# EAGLE design XStepper (EAGLE 6.4)
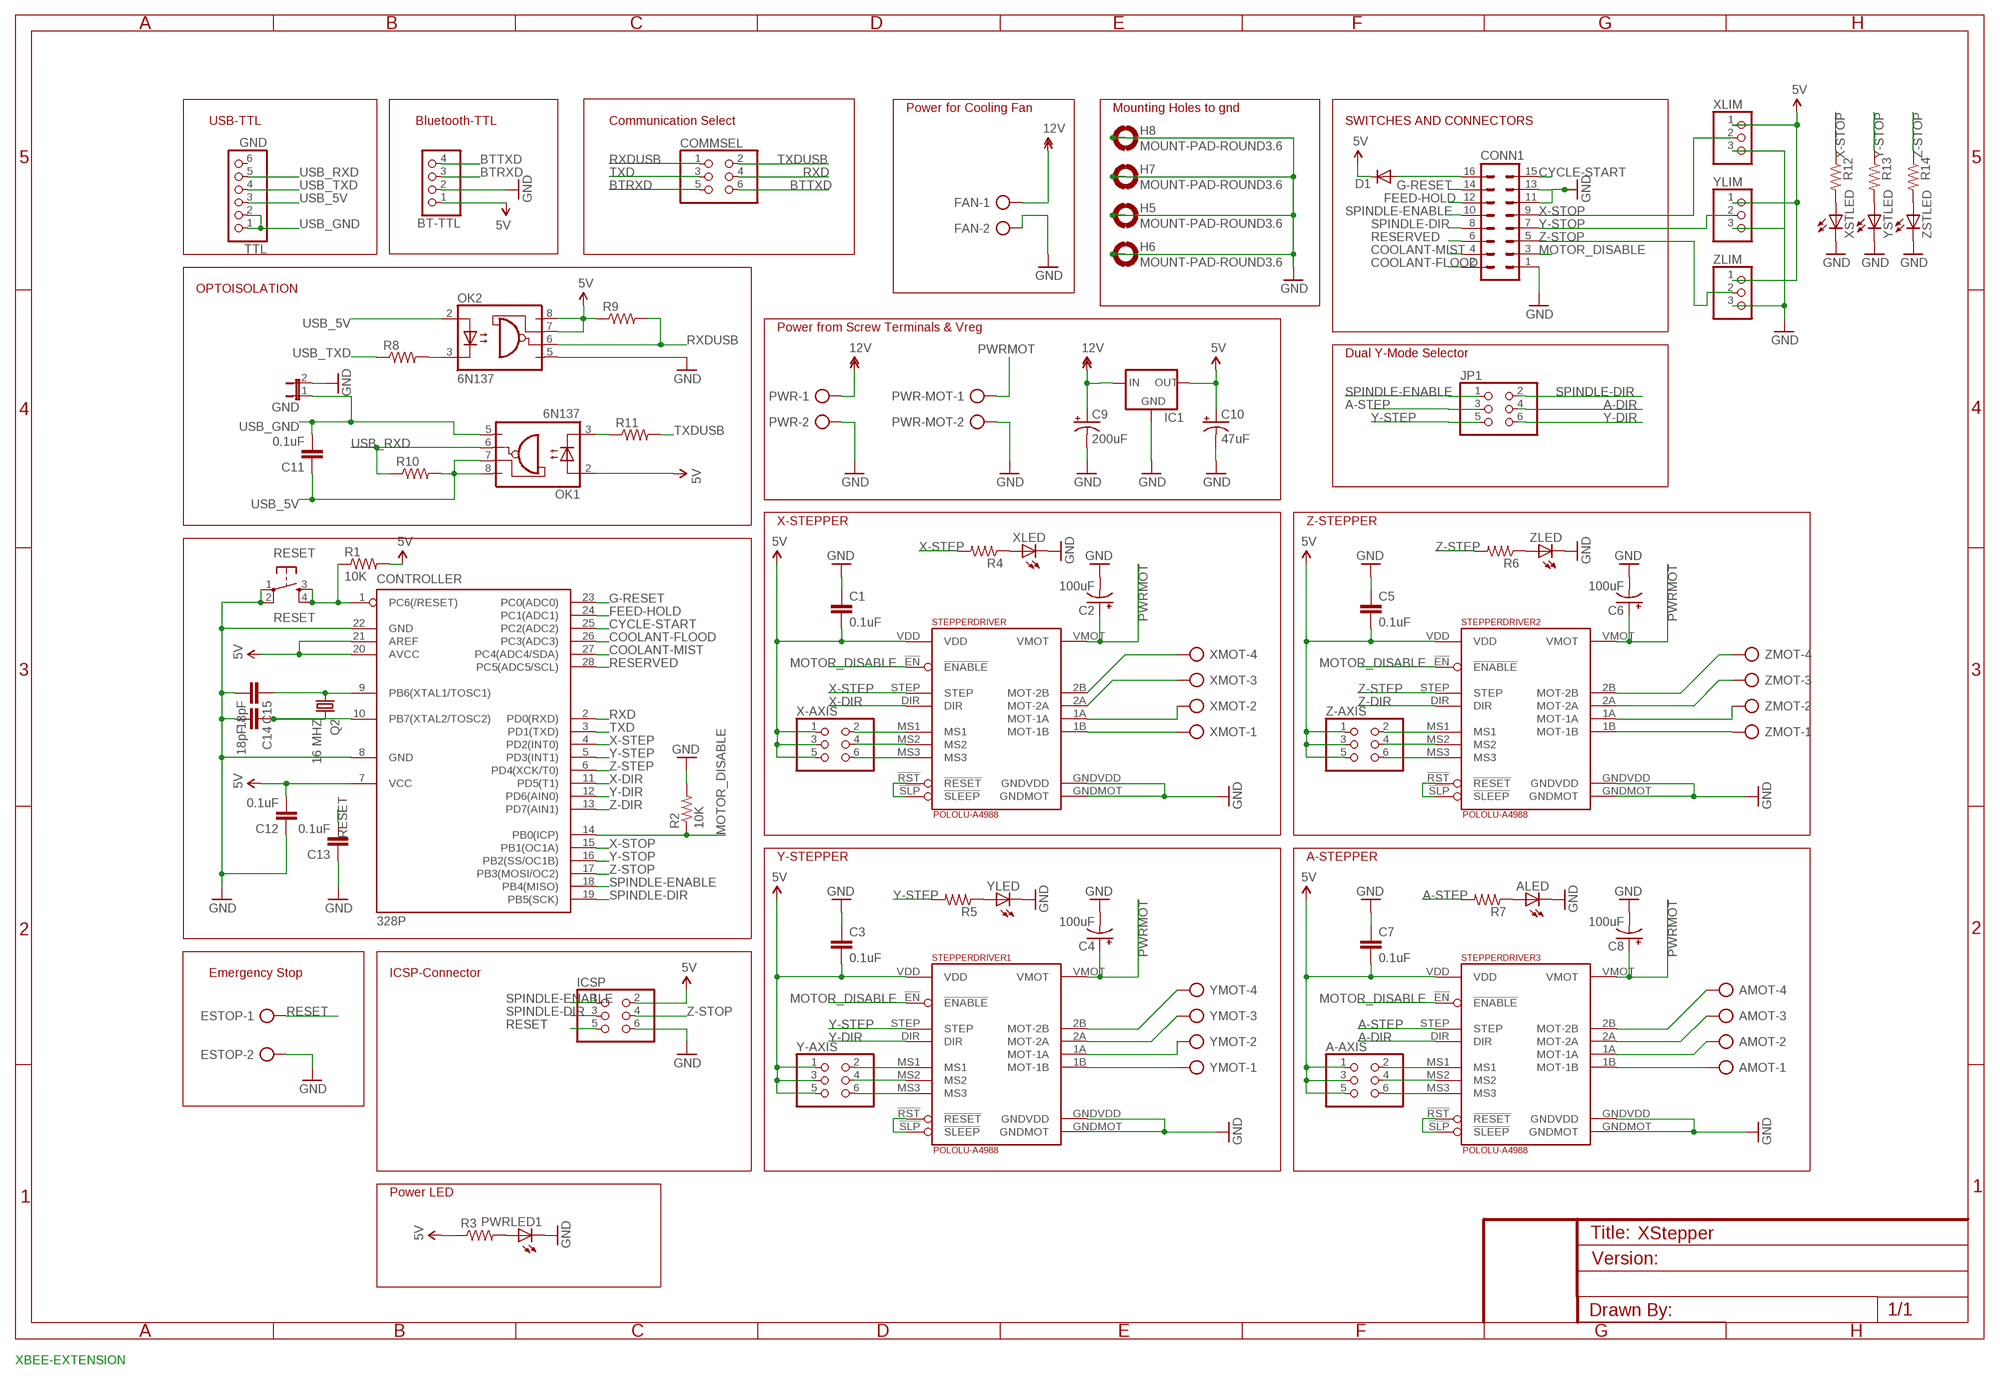
[diagram p0: schematic, sheet 1]

## Parts
328P  CONTROLLER  MEGA8-P  [DIL28-3]
A-AXIS  PINHD-2X3  [2X03]
ALED  LED3MM  [LED3MM]
AMOT  AK500/4  [AK500/4]
BT-TTL  PINHD-1X4  [1X04]
C1  0.1uF  C-EU025-025X050  [C025-025X050]
C2  100uF  CPOL-USE2.5-6  [E2,5-6]
C3  0.1uF  C-EU025-025X050  [C025-025X050]
C4  100uF  CPOL-USE2.5-6  [E2,5-6]
C5  0.1uF  C-EU025-025X050  [C025-025X050]
C6  100uF  CPOL-USE2.5-6  [E2,5-6]
C7  0.1uF  C-EU025-025X050  [C025-025X050]
C8  100uF  CPOL-USE2.5-6  [E2,5-6]
C9  200uF  CPOL-USE2.5-6  [E2,5-6]
C10  47uF  CPOL-USE2.5-6  [E2,5-6]
C11  0.1uF  C-EU025-025X050  [C025-025X050]
C12  0.1uF  C-EU025-025X050  [C025-025X050]
C13  0.1uF  C-EU025-025X050  [C025-025X050]
C14  18pF  C-EU025-025X050  [C025-025X050]
C15  18pF  C-EU025-025X050  [C025-025X050]
COMMSEL  PINHD-2X3  [2X03]
CONN1  ML16  [ML16]
D1  DIODEPTH  [DIODE-1N4001]
ESTOP  AK500/2  [AK500/2]
FAN  AK500/2  [AK500/2]
GND  JP1E  [JP1]
H5  MOUNT-PAD-ROUND3.6  [3,6-PAD]
H6  MOUNT-PAD-ROUND3.6  [3,6-PAD]
H7  MOUNT-PAD-ROUND3.6  [3,6-PAD]
H8  MOUNT-PAD-ROUND3.6  [3,6-PAD]
IC1  V_REG_78XXSINK  [TO220-IGO]
ICSP  PINHD-2X3  [2X03]
JP1  PINHD-2X3  [2X03]
OK1  6N137  [DIL08]
OK2  6N137  [DIL08]
PWR  AK500/2  [AK500/2]
PWR-MOT  AK500/2  [AK500/2]
PWRLED1  LED3MM  [LED3MM]
Q2  16 MHZ  CRYSTALHC49S  [HC49/S]
R1  10K  RESISTORAXIAL-0.3  [AXIAL-0.3]
R2  10K  RESISTORAXIAL-0.3  [AXIAL-0.3]
R3  RESISTORAXIAL-0.3  [AXIAL-0.3]
R4  RESISTORAXIAL-0.3  [AXIAL-0.3]
R5  RESISTORAXIAL-0.3  [AXIAL-0.3]
R6  RESISTORAXIAL-0.3  [AXIAL-0.3]
R7  RESISTORAXIAL-0.3  [AXIAL-0.3]
R8  RESISTORAXIAL-0.3  [AXIAL-0.3]
R9  RESISTORAXIAL-0.3  [AXIAL-0.3]
R10  RESISTORAXIAL-0.3  [AXIAL-0.3]
R11  RESISTORAXIAL-0.3  [AXIAL-0.3]
R12  RESISTORAXIAL-0.3  [AXIAL-0.3]
R13  RESISTORAXIAL-0.3  [AXIAL-0.3]
R14  RESISTORAXIAL-0.3  [AXIAL-0.3]
RESET  RESET  TAC_SWITCHPTH  [TACTILE-PTH]
STEPPERDRIVER  POLOLU-A4988  POLOLU-ALLEGRO  [POLOLU-ALLEGRO-PTH]
STEPPERDRIVER1  POLOLU-A4988  POLOLU-ALLEGRO  [POLOLU-ALLEGRO-PTH]
STEPPERDRIVER2  POLOLU-A4988  POLOLU-ALLEGRO  [POLOLU-ALLEGRO-PTH]
STEPPERDRIVER3  POLOLU-A4988  POLOLU-ALLEGRO  [POLOLU-ALLEGRO-PTH]
TTL  GND  PINHD-1X6  [1X06]
X-AXIS  PINHD-2X3  [2X03]
XLED  LED3MM  [LED3MM]
XLIM  PINHD-1X3  [1X03]
XMOT  AK500/4  [AK500/4]
XSTLED  LED3MM  [LED3MM]
Y-AXIS  PINHD-2X3  [2X03]
YLED  LED3MM  [LED3MM]
YLIM  PINHD-1X3  [1X03]
YMOT  AK500/4  [AK500/4]
YSTLED  LED3MM  [LED3MM]
Z-AXIS  PINHD-2X3  [2X03]
ZLED  LED3MM  [LED3MM]
ZLIM  PINHD-1X3  [1X03]
ZMOT  AK500/4  [AK500/4]
ZSTLED  LED3MM  [LED3MM]

## Nets
5V: 328P.7(VCC) 328P.20(AVCC) 328P.21(AREF) A-AXIS.1 A-AXIS.3 A-AXIS.5 BT-TTL.1 C1.2 C3.2 C5.2 C7.2 C10.+ C12.2 D1.C IC1.OUT ICSP.2 OK1.2(A) OK2.7(VE) OK2.8(VCC) R1.P$2 R3.P$1 R9.P$1 STEPPERDRIVER1.VDD STEPPERDRIVER2.VDD STEPPERDRIVER3.VDD STEPPERDRIVER.VDD X-AXIS.1 X-AXIS.3 X-AXIS.5 XLIM.1 Y-AXIS.1 Y-AXIS.3 Y-AXIS.5 YLIM.1 Z-AXIS.1 Z-AXIS.3 Z-AXIS.5 ZLIM.1
12V [power]: C9.+ FAN.1 IC1.IN PWR.1
A-DIR: JP1.4 STEPPERDRIVER3.DIR
A-STEP: JP1.3 R7.P$2 STEPPERDRIVER3.STEP
BTRXD: BT-TTL.3 COMMSEL.5
BTTXD: BT-TTL.4 COMMSEL.6
COOLANT-FLOOD: 328P.26(PC3(ADC3)) CONN1.2
COOLANT-MIST: 328P.27(PC4(ADC4/SDA)) CONN1.4
CYCLE-START: 328P.25(PC2(ADC2)) CONN1.15
FEED-HOLD: 328P.24(PC1(ADC1)) CONN1.12
G-RESET: 328P.23(PC0(ADC0)) CONN1.14
GND [power]: 328P.8(GND) 328P.22(GND) ALED.K(C) BT-TTL.2 C1.1 C2.- C3.1 C4.- C5.1 C6.- C7.1 C8.- C9.- C10.- C12.1 C13.1 C14.2 C15.2 CONN1.1 CONN1.11 CONN1.13 ESTOP.2 FAN.2 GND.2 H5.B3,6(MOUNT) H6.B3,6(MOUNT) H7.B3,6(MOUNT) H8.B3,6(MOUNT) IC1.GND ICSP.6 OK2.5(GND) PWR-MOT.2 PWR.2 PWRLED1.K(C) R2.P$2 RESET.1 RESET.2 STEPPERDRIVER1.GNDMOT STEPPERDRIVER1.GNDVDD STEPPERDRIVER2.GNDMOT STEPPERDRIVER2.GNDVDD STEPPERDRIVER3.GNDMOT STEPPERDRIVER3.GNDVDD STEPPERDRIVER.GNDMOT STEPPERDRIVER.GNDVDD XLED.K(C) XLIM.3 XSTLED.K(C) YLED.K(C) YLIM.3 YSTLED.K(C) ZLED.K(C) ZLIM.3 ZSTLED.K(C)
MOTOR_DISABLE: 328P.14(PB0(ICP)) CONN1.3 R2.P$1 STEPPERDRIVER1.!EN(!ENABLE) STEPPERDRIVER2.!EN(!ENABLE) STEPPERDRIVER3.!EN(!ENABLE) STEPPERDRIVER.!EN(!ENABLE)
N$1 [power]: STEPPERDRIVER.1B(MOT-1B) XMOT.1
N$2 [power]: STEPPERDRIVER.1A(MOT-1A) XMOT.2
N$3 [power]: STEPPERDRIVER.2A(MOT-2A) XMOT.3
N$4 [power]: STEPPERDRIVER.2B(MOT-2B) XMOT.4
N$5: STEPPERDRIVER.!RST(!RESET) STEPPERDRIVER.!SLP(!SLEEP)
N$6: STEPPERDRIVER.MS1 X-AXIS.2
N$7: STEPPERDRIVER.MS2 X-AXIS.4
N$8: STEPPERDRIVER.MS3 X-AXIS.6
N$9 [power]: STEPPERDRIVER1.1B(MOT-1B) YMOT.1
N$10 [power]: STEPPERDRIVER1.1A(MOT-1A) YMOT.2
N$11 [power]: STEPPERDRIVER1.2A(MOT-2A) YMOT.3
N$12 [power]: STEPPERDRIVER1.2B(MOT-2B) YMOT.4
N$13: STEPPERDRIVER1.!RST(!RESET) STEPPERDRIVER1.!SLP(!SLEEP)
N$14: STEPPERDRIVER1.MS1 Y-AXIS.2
N$15: STEPPERDRIVER1.MS2 Y-AXIS.4
N$16: STEPPERDRIVER1.MS3 Y-AXIS.6
N$17 [power]: STEPPERDRIVER2.2B(MOT-2B) ZMOT.4
N$18 [power]: STEPPERDRIVER2.2A(MOT-2A) ZMOT.3
N$19 [power]: STEPPERDRIVER2.1A(MOT-1A) ZMOT.2
N$20 [power]: STEPPERDRIVER2.1B(MOT-1B) ZMOT.1
N$21: STEPPERDRIVER2.!RST(!RESET) STEPPERDRIVER2.!SLP(!SLEEP)
N$22: STEPPERDRIVER2.MS1 Z-AXIS.2
N$23: STEPPERDRIVER2.MS2 Z-AXIS.4
N$24: STEPPERDRIVER2.MS3 Z-AXIS.6
N$25 [power]: AMOT.1 STEPPERDRIVER3.1B(MOT-1B)
N$26 [power]: AMOT.2 STEPPERDRIVER3.1A(MOT-1A)
N$27 [power]: AMOT.3 STEPPERDRIVER3.2A(MOT-2A)
N$28 [power]: AMOT.4 STEPPERDRIVER3.2B(MOT-2B)
N$29: STEPPERDRIVER3.!RST(!RESET) STEPPERDRIVER3.!SLP(!SLEEP)
N$30: A-AXIS.2 STEPPERDRIVER3.MS1
N$31: A-AXIS.4 STEPPERDRIVER3.MS2
N$32: A-AXIS.6 STEPPERDRIVER3.MS3
N$33: 328P.9(PB6(XTAL1/TOSC1)) C15.1 Q2.1
N$34: 328P.10(PB7(XTAL2/TOSC2)) C14.1 Q2.2
N$35: OK2.3(C) R8.P$2
N$36: OK1.3(C) R11.P$1
N$37: R12.P$2 XSTLED.A
N$38: R4.P$1 XLED.A
N$39: R5.P$1 YLED.A
N$40: R6.P$1 ZLED.A
N$41: ALED.A R7.P$1
N$42: R13.P$2 YSTLED.A
N$43: PWRLED1.A R3.P$2
N$44: R14.P$2 ZSTLED.A
N$45: CONN1.16 D1.A
PWRMOT: C2.+ C4.+ C6.+ C8.+ PWR-MOT.1 STEPPERDRIVER1.VMOT STEPPERDRIVER2.VMOT STEPPERDRIVER3.VMOT STEPPERDRIVER.VMOT
RESERVED: 328P.28(PC5(ADC5/SCL)) CONN1.6
RESET: 328P.1(PC6(/RESET)) C13.2 ESTOP.1 ICSP.5 R1.P$1 RESET.3 RESET.4
RXD: 328P.2(PD0(RXD)) COMMSEL.4
RXDUSB: COMMSEL.1 OK2.6(VO) R9.P$2
SPINDLE-DIR: 328P.19(PB5(SCK)) CONN1.8 ICSP.3 JP1.2
SPINDLE-ENABLE: 328P.18(PB4(MISO)) CONN1.10 ICSP.1 JP1.1
TXD: 328P.3(PD1(TXD)) COMMSEL.3
TXDUSB: COMMSEL.2 R11.P$2
USB_5V: C11.1 OK1.7(VE) OK1.8(VCC) OK2.2(A) R10.P$2 TTL.3
USB_GND [power]: C11.2 GND.1 OK1.5(GND) TTL.1 TTL.2
USB_RXD: OK1.6(VO) R10.P$1 TTL.5
USB_TXD: R8.P$1 TTL.4
X-DIR: 328P.11(PD5(T1)) STEPPERDRIVER.DIR
X-STEP: 328P.4(PD2(INT0)) R4.P$2 STEPPERDRIVER.STEP
X-STOP: 328P.15(PB1(OC1A)) CONN1.9 R12.P$1 XLIM.2
Y-DIR: 328P.12(PD6(AIN0)) JP1.6 STEPPERDRIVER1.DIR
Y-STEP: 328P.5(PD3(INT1)) JP1.5 R5.P$2 STEPPERDRIVER1.STEP
Y-STOP: 328P.16(PB2(SS/OC1B)) CONN1.7 R13.P$1 YLIM.2
Z-DIR: 328P.13(PD7(AIN1)) STEPPERDRIVER2.DIR
Z-STEP: 328P.6(PD4(XCK/T0)) R6.P$2 STEPPERDRIVER2.STEP
Z-STOP: 328P.17(PB3(MOSI/OC2)) CONN1.5 ICSP.4 R14.P$1 ZLIM.2
Unconnected: TTL.6

## Notes on the sheet
- Power for Cooling Fan | Mounting Holes to gnd
- USB-TTL | Bluetooth-TTL | Communication Select | SWITCHES AND CONNECTORS
- OPTOISOLATION
- Power from Screw Terminals & Vreg
- Dual Y-Mode Selector
- X-STEPPER | Z-STEPPER
- Y-STEPPER | A-STEPPER
- Emergency Stop | ICSP-Connector
- Power LED
- XBEE-EXTENSION

## Library data of the parts
328P = Bibsatmel:MEGA8-P: MICROCONTROLLER 8 Kbytes FLASH, 1 kbytes SRAM, 512 bytes EEPROM, USART, 4-channel 10 bit ADC, 2-channel 8 bit ADC Pin compatible with Atmega48, ATMega88, ATMega168 Source: avr.lbr; OC_FARNELL: unknown; OC_NEWARK: unknown
A-AXIS COMMSEL ICSP JP1 X-AXIS Y-AXIS Z-AXIS = pinhead:PINHD-2X3: PIN HEADER
ALED PWRLED1 XLED XSTLED YLED YSTLED ZLED ZSTLED = led:LED: LED OSRAM: - CHIPLED LG R971, LG N971, LY N971, LG Q971, LY Q971, LO R971, LY R971 LH N974, LH R974 LS Q976, LO Q976, LY Q976 LO Q996 - Hyper CHIPLED LW Q18S LB Q993, LB Q99A, LB R99A - SideLED LS A670, LO A670, LY A670, LG A670, LP A670 LB A673, LV A673, LT A673, LW A673 LH A674 LY A675 LS A676, LA A676, LO A676, LY A676, LW A676 LS A679, LY A679, LG A679 - Hyper Micro SIDELED® LS Y876, LA Y876, LO Y876, LY Y876 LT Y87S - SmartLED LW L88C, LW L88S LB L89C, LB L89S, LG L890 LS L89K, LO L89K, LY L89K LS L896, LA L896, LO L896, LY L896 - TOPLED LS T670, LO T670, LY T670, LG T670, LP T670 LSG T670, LSP T670, LSY T670, LOP T670, LYG T670 LG T671, LOG T671, LSG T671 LB T673, LV T673, LT T673, LW T673 LH T674 LS T676, LA T676, LO T676, LY T676, LB T676, LH T676, LSB T676, LW T676 LB T67C, LV T67C, LT T67C, LS T67K, LO T67K, LY T67K, LW E67C LS E67B, LA E67B, LO E67B, LY E67B, LB E67C, LV E67C, LT E67C LW T67C LS T679, LY T679, LG T679 LS T770, LO T770, LY T770, LG T770, LP T770 LB T773, LV T773, LT T773, LW T773 LH T774 LS E675, LA E675, LY E675, LS T675 LS T776, LA T776, LO T776, LY T776, LB T776 LHGB T686 LT T68C, LB T68C - Hyper Mini TOPLED® LB M676 - Mini TOPLED Santana® LG M470 LS M47K, LO M47K, LY M47K Source: http://www.osram.convergy.de LUXEON: - LUMILED® LXK2-PW12-R00, LXK2-PW12-S00, LXK2-PW14-U00, LXK2-PW14-V00 LXK2-PM12-R00, LXK2-PM12-S00, LXK2-PM14-U00 LXK2-PE12-Q00, LXK2-PE12-R00, LXK2-PE12-S00, LXK2-PE14-T00, LXK2-PE14-U00 LXK2-PB12-K00, LXK2-PB12-L00, LXK2-PB12-M00, LXK2-PB14-N00, LXK2-PB14-P00, LXK2-PB14-Q00 LXK2-PR12-L00, LXK2-PR12-M00, LXK2-PR14-Q00, LXK2-PR14-R00 LXK2-PD12-Q00, LXK2-PD12-R00, LXK2-PD12-S00 LXK2-PH12-R00, LXK2-PH12-S00 LXK2-PL12-P00, LXK2-PL12-Q00, LXK2-PL12-R00 Source: www.luxeon.com KINGBRIGHT: KA-3528ASYC Source: www.kingbright.com
AMOT XMOT YMOT ZMOT = con-ptr500:AK500/4: CONNECTOR; OC_FARNELL: unknown; OC_NEWARK: unknown
BT-TTL = pinhead:PINHD-1X4: PIN HEADER
C1 C3 C5 C7 C11-C15 = resistor:C-EU: CAPACITOR, European symbol
C2 C4 C6 C8-C10 = resistor:CPOL-US: POLARIZED CAPACITOR, American symbol
CONN1 = con-ml:ML16: HARTING; OC_FARNELL: unknown; OC_NEWARK: unknown
D1 = SparkFun-DiscreteSemi:DIODE: Diode These are standard reverse protection diodes and small signal diodes. SMA package can handle up to about 1A. SOD-323 can handle about 200mA. What the SOD-323 package when ordering, there are some mfgs out there that are 5-pin packages.
ESTOP FAN PWR PWR-MOT = con-ptr500:AK500/2: CONNECTOR; OC_FARNELL: unknown; OC_NEWARK: unknown
GND = jumper:JP1E: JUMPER
H5-H8 = holes:MOUNT-PAD-ROUND: MOUNTING PAD, round
IC1 = SparkFun-PowerIC:V_REG_78XX: Voltage Regulator Standard 7805 5V regulator. IGO (Input Ground Output). Spark Fun Electronics SKU : COM-00107
OK1 OK2 = optocoupler:6N137: MOTOROLA OPTO COUPLER; MPN: 6N137; OC_FARNELL: 1328376; OC_NEWARK: 52M1895
Q2 = crystal:CRYSTAL: CRYSTAL; OC_FARNELL: 1667008; OC_NEWARK: unknown
R1-R14 = SparkFun-Resistors:RESISTOR: Resistor Basic schematic elements and footprints for 0603, 1206, and PTH resistors.
RESET = SparkFun:TAC_SWITCH: Momentary Switch Button commonly used for reset or general input. Spark Fun Electronics SKU : COM-00097
STEPPERDRIVER STEPPERDRIVER1-STEPPERDRIVER3 = pololu-allegro:POLOLU-ALLEGRO
TTL = pinhead:PINHD-1X6: PIN HEADER
XLIM YLIM ZLIM = pinhead:PINHD-1X3: PIN HEADER

## Net classes
0 default: width 0.406 mm, clearance 0.254 mm
1 power: width 1.016 mm, clearance 0.305 mm

## Board
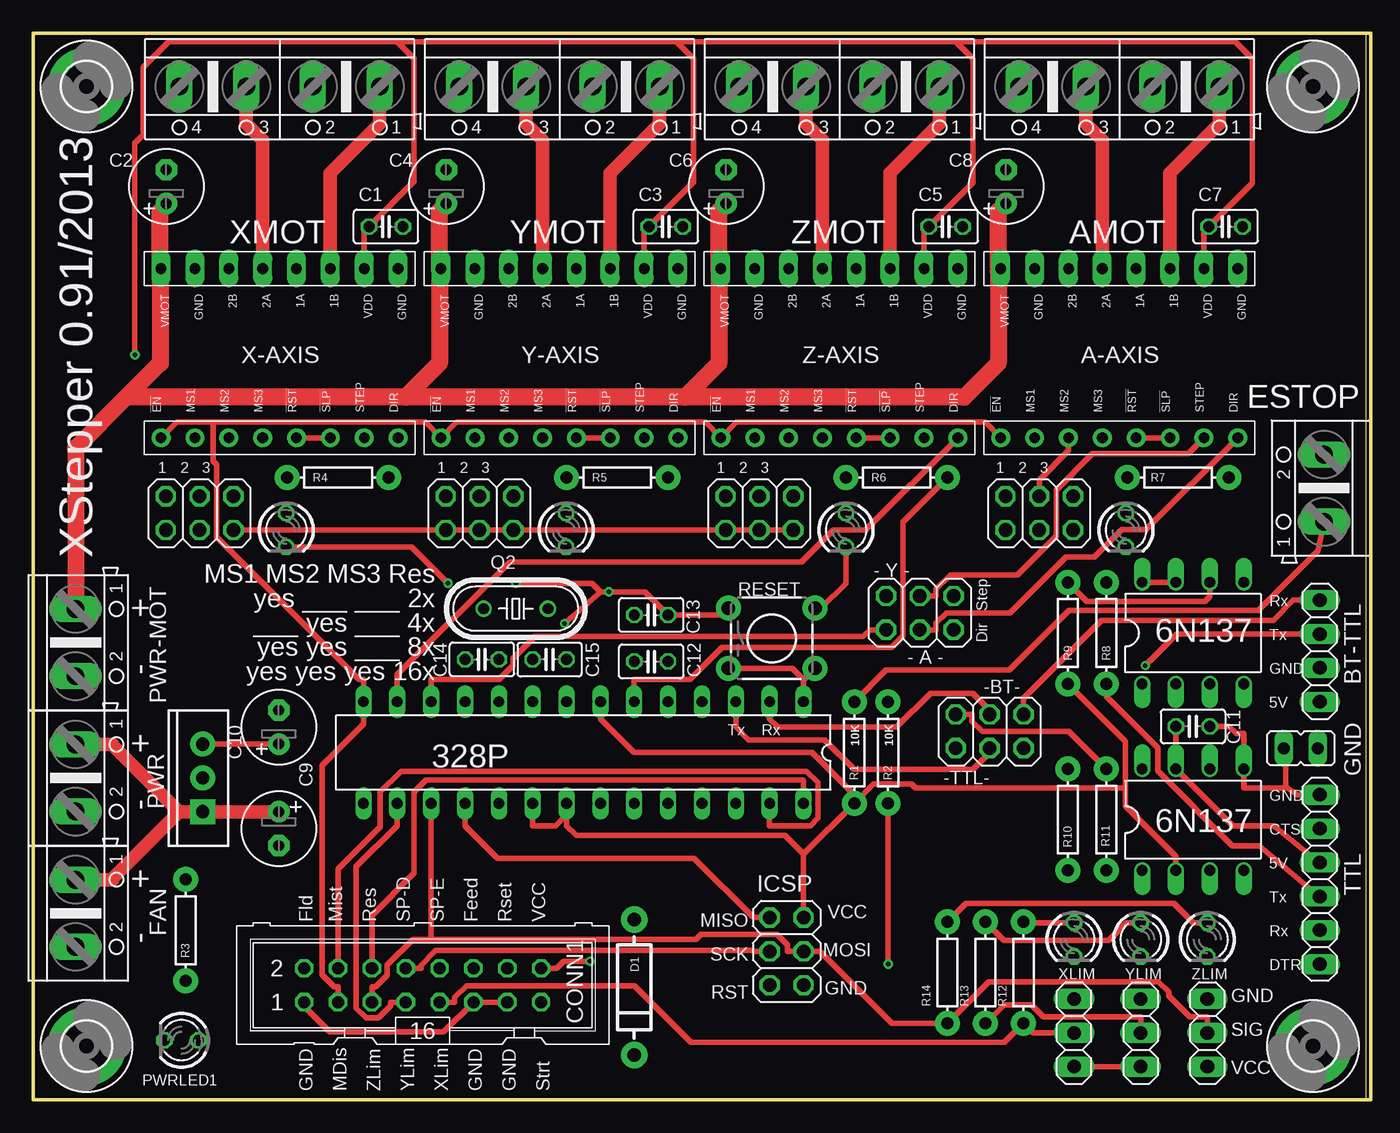
[diagram p1: board, top side]
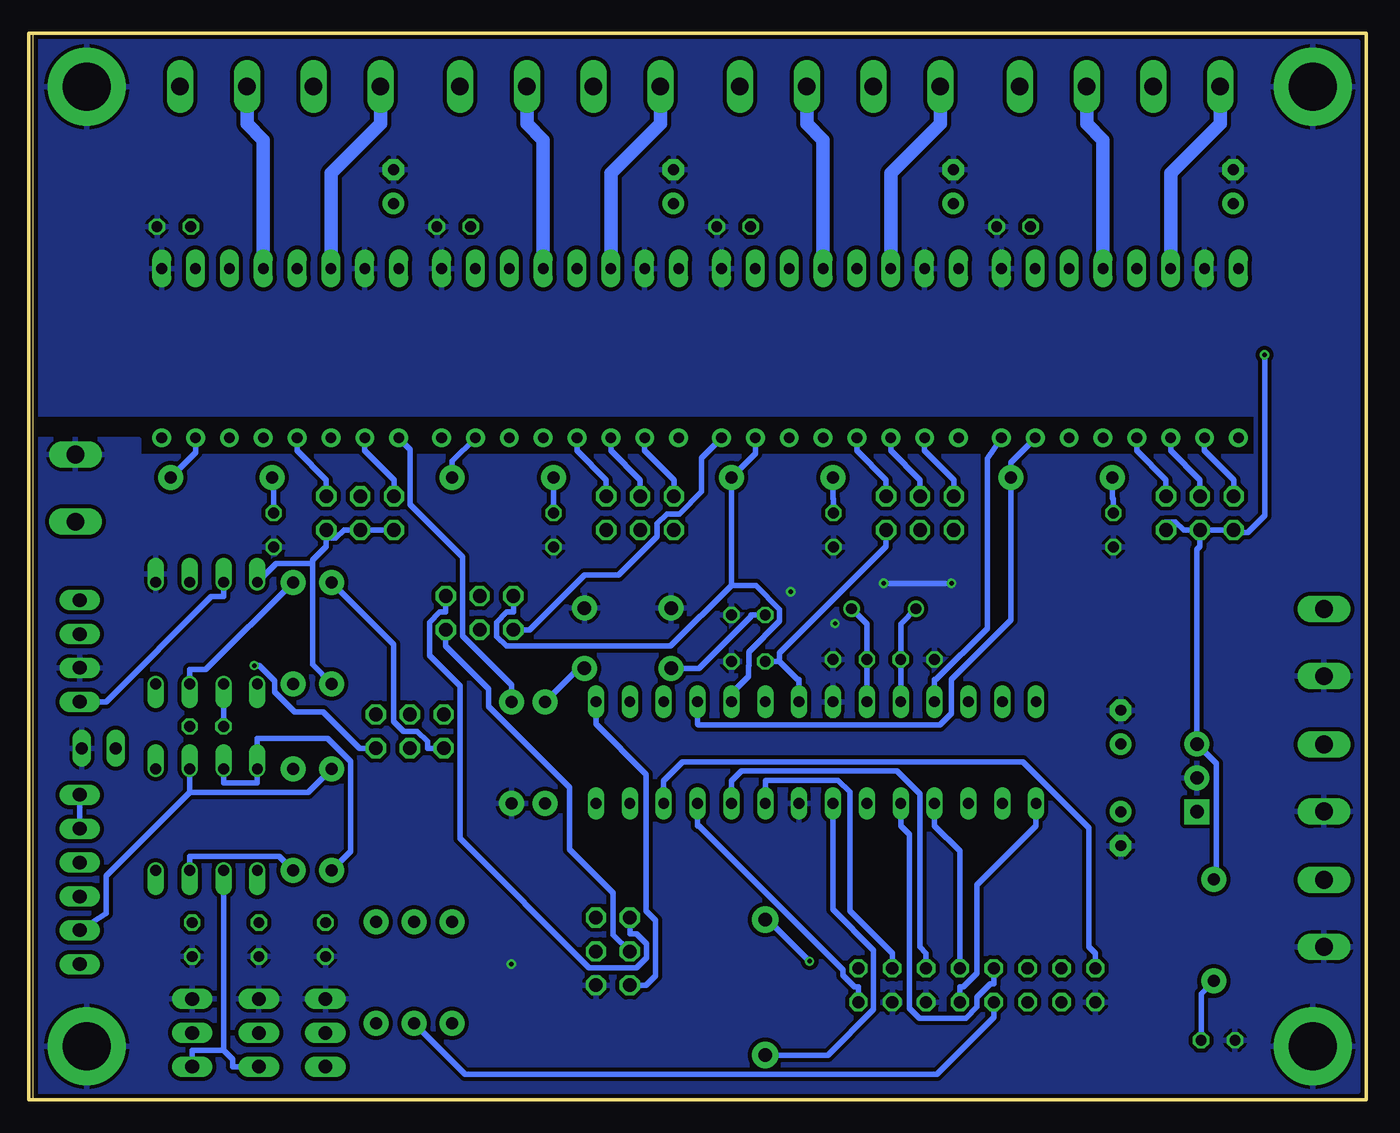
[diagram p2: board, bottom side, seen from below]

Size 100 x 80 mm. Coordinates in mm from the lower left corner, seen from the top.
Outline: 0,0 100,0 100,80 0,80 0,0
Copper layers (1*16): Top 0.0356mm / dielectric 1.5011mm / Bottom 0.0356mm
Design rules "LaenPCBOrder": minimum track width 6mil, minimum drill 13mil, track to track 6mil, track to pad 6mil, pad to pad 6mil, via to via 6mil, smd to smd 6mil, copper to edge 15mil, drill to drill 6mil, minimum pad ring 7mil, minimum via ring 7mil, stop-mask expansion 4mil, vias tented up to drill 0mil, thermal gap 10mil
Milling: 4 lines

### Footprints (pad centres in the part's own frame; a part is rotated, then mirrored left to right if it is on the bottom)
DIL28-3 = drill 0.813 long: 1 -16.51,-3.81; 2 -13.97,-3.81; 3 -11.43,-3.81; 4 -8.89,-3.81; 5 -6.35,-3.81; 6 -3.81,-3.81; 7 -1.27,-3.81; 8 1.27,-3.81; 9 3.81,-3.81; 10 6.35,-3.81; 11 8.89,-3.81; 12 11.43,-3.81; 13 13.97,-3.81; 14 16.51,-3.81; 15 16.51,3.81; 16 13.97,3.81; 17 11.43,3.81; 18 8.89,3.81; 19 6.35,3.81; 20 3.81,3.81; 21 1.27,3.81; 22 -1.27,3.81; 23 -3.81,3.81; 24 -6.35,3.81; 25 -8.89,3.81; 26 -11.43,3.81; 27 -13.97,3.81; 28 -16.51,3.81
2X03 = drill 1.016 octagon: 1 -2.54,-1.27; 2 -2.54,1.27; 3 0,-1.27; 4 0,1.27; 5 2.54,-1.27; 6 2.54,1.27
LED3MM = drill 0.813 octagon: A -1.27,0; K 1.27,0
AK500/4 = drill 1.321 long: 1 -7.518,0; 2 -2.489,0; 3 2.489,0; 4 7.518,0
1X04 = drill 1.016 long: 1 -3.81,0; 2 -1.27,0; 3 1.27,0; 4 3.81,0
C025-025X050 = drill 0.813 octagon: 1 -1.27,0; 2 1.27,0
E2,5-6 = drill 0.813 pad 1.6: + -1.27,0 | drill 0.813 pad 1.6 octagon: - 1.27,0
ML16 = drill 0.914 octagon: 1 -8.89,-1.27; 2 -8.89,1.27; 3 -6.35,-1.27; 4 -6.35,1.27; 5 -3.81,-1.27; 6 -3.81,1.27; 7 -1.27,-1.27; 8 -1.27,1.27; 9 1.27,-1.27; 10 1.27,1.27; 11 3.81,-1.27; 12 3.81,1.27; 13 6.35,-1.27; 14 6.35,1.27; 15 8.89,-1.27; 16 8.89,1.27
DIODE-1N4001 = drill 1 pad 1.981: A -5.08,0; C 5.08,0
AK500/2 = drill 1.321 long: 1 -2.515,0; 2 2.515,0
JP1 = drill 0.914 long: 1 0,-1.27; 2 0,1.27
3,6-PAD = drill 3.6 pad 5.842: B3,6 0,0
TO220-IGO = drill 1 pad 1.88: GND 0,0; OUT 2.54,0 | drill 1 pad 1.88 square: IN -2.54,0
DIL08 = drill 0.813 offset: 1 -3.81,-3.81; 2 -1.27,-3.81; 3 1.27,-3.81; 4 3.81,-3.81; 5 3.81,3.81; 6 1.27,3.81; 7 -1.27,3.81; 8 -3.81,3.81
HC49/S = drill 0.813: 1 -2.413,0; 2 2.413,0
AXIAL-0.3 = drill 0.9 pad 1.88: P$1 -3.81,0; P$2 3.81,0
TACTILE-PTH = drill 1.016 pad 1.88: 1 -3.251,2.261; 2 3.251,2.261; 3 -3.251,-2.261; 4 3.251,-2.261
POLOLU-ALLEGRO-PTH = drill 0.8 pad 1.422 long: 1A 6.35,-1.27; 1B 6.35,-3.81; 2A 6.35,1.27; 2B 6.35,3.81; GNDMOT 6.35,6.35; GNDVDD 6.35,-8.89; VDD 6.35,-6.35; VMOT 6.35,8.89 | drill 0.8 pad 1.422: !EN -6.35,8.89; !RST -6.35,-1.27; !SLP -6.35,-3.81; DIR -6.35,-8.89; MS1 -6.35,6.35; MS2 -6.35,3.81; MS3 -6.35,1.27; STEP -6.35,-6.35
1X06 = drill 1.016 long: 1 -6.35,0; 2 -3.81,0; 3 -1.27,0; 4 1.27,0; 5 3.81,0; 6 6.35,0
1X03 = drill 1.016 long: 1 -2.54,0; 2 0,0; 3 2.54,0

### Placement (x,y rotation side)
328P  41.27,26.04 180 top
A-AXIS  75.48,44 0 top
ALED  81.98,42.73 270 top
AMOT  81.48,76 180 top
BT-TTL  96.52,33.66 90 top
C1  26.45,65.5 180 top
C2  9.98,68.5 90 top
C3  47.45,65.5 180 top
C4  30.98,68.5 90 top
C5  68.45,65.5 180 top
C6  51.98,68.5 90 top
C7  89.45,65.5 180 top
C8  72.98,68.5 90 top
C9  18.41,20.32 270 top
C10  18.41,27.94 90 top
C11  87,28 0 top
C12  46.35,32.86 180 top
C13  46.35,36.35 180 top
C14  33.66,33.02 180 top
C15  38.73,33.02 0 top
COMMSEL  71.75,27.62 0 top
CONN1  29.21,8.57 0 top
D1  45.09,8.41 270 top
ESTOP  96.84,45.88 90 top
FAN  3.17,13.97 270 top
GND  95.09,26.35 270 top
H5  96,76 0 top
H6  4,4 0 top
H7  4,76 0 top
H8  96,4 0 top
IC1  12.7,24.13 90 top
ICSP  56.52,11.11 270 top
JP1  66.52,36.51 180 top
OK1  87,21 0 top
OK2  87,35 0 top
PWR  3.17,24.13 270 top
PWR-MOT  3.17,34.29 270 top
PWRLED1  11.11,4.45 180 top
Q2  36.2,36.83 180 top
R1  61.59,26.04 270 top
R2  64.14,26.04 270 top
R3  11.43,12.7 270 top
R4  22.86,46.67 0 top
R5  43.82,46.67 0 top
R6  64.77,46.67 0 top
R7  85.88,46.67 0 top
R8  80.5,35 90 top
R9  77.62,35 90 top
R10  77.62,21 270 top
R11  80.5,21 90 top
R12  74.3,9.53 90 top
R13  71.44,9.53 90 top
R14  68.58,9.53 90 top
RESET  55.4,34.61 0 top
STEPPERDRIVER  18.48,56 90 top
STEPPERDRIVER1  39.48,56 90 top
STEPPERDRIVER2  60.48,56 90 top
STEPPERDRIVER3  81.48,56 90 top
TTL  96.52,16.51 270 top
X-AXIS  12.48,44 0 top
XLED  18.98,42.73 270 top
XLIM  78.08,5 90 top
XMOT  18.48,76 180 top
XSTLED  78.08,12 270 top
Y-AXIS  33.48,44 0 top
YLED  39.98,42.73 270 top
YLIM  83.08,5 90 top
YMOT  39.48,76 180 top
YSTLED  83.08,12 270 top
Z-AXIS  54.48,44 0 top
ZLED  60.98,42.73 270 top
ZLIM  88.08,5 90 top
ZMOT  60.48,76 180 top
ZSTLED  88.08,12 270 top

### Tracks (layer width: path | path; a pad name or v marks a point on that pad's centre or on a via)
5V  (via drill 0.33 pad 0.69)
  Top 0.406: X-AXIS.5 Y-AXIS.1 Y-AXIS.3 Y-AXIS.5 Z-AXIS.1 Z-AXIS.3 Z-AXIS.5 | 81.94,23.39 66.17,23.39 65.88,23.68 63.05,23.68 R1.P$2 | 81.94,23.39 81.94,22.05 85.73,18.26 OK1.2 | R9.P$1 81.94,26.88 81.94,23.39 | 328P.20 37.47,20.55 39.17,20.55 40.01,21.39 | 40.01,21.39 40.01,20.55 40.75,19.81 56.39,19.81 57.78,18.41 | 328P.21 40.01,21.39 | 57.78,18.41 R1.P$2 | ICSP.2 57.78,18.41 | IC1.OUT C10.+ | YLIM.1 XLIM.1 | OK2.8 OK2.7 | 69.22,79.38 90.17,79.38 91.44,78.11 91.44,68.76 C7.2 87.83,65.14 STEPPERDRIVER3.VDD | 69.22,79.38 48.26,79.38 | 48.26,79.38 27.3,79.38 | 27.3,79.38 10.16,79.38 8.26,77.47 8.26,72.39 7.62,71.75 v7.62,55.88 | 27.3,79.38 28.57,78.11 28.57,68.89 C1.2 24.83,65.14 STEPPERDRIVER.VDD | 48.26,79.38 49.53,78.11 49.53,68.85 C3.2 45.83,65.14 STEPPERDRIVER1.VDD | 69.22,79.38 70.48,78.11 70.48,68.8 C5.2 66.83,65.14 STEPPERDRIVER2.VDD | 328P.7 42.55,28.57 45.09,26.04 58.42,26.04 61.59,22.86 R1.P$2
  Bottom 0.406: 78.02,42.12 77.31,42.12 76.69,42.73 A-AXIS.3 A-AXIS.1 | 78.02,42.12 78.02,41.51 79.06,40.46 79.06,40.21 | A-AXIS.5 78.02,42.12 | R9.P$1 79.06,32.63 79.06,40.21 | 79.06,40.21 81.79,40.21 OK2.8 | 328P.21 40.01,14.26 36.95,11.21 36.95,6.78 40.4,3.33 D1.C | OK2.7 85.73,37.74 86.64,37.74 94.54,29.84 BT-TTL.1 | X-AXIS.3 13.7,42.73 14.3,43.34 15.02,43.34 X-AXIS.5 | 85.73,3.68 85.06,3.01 85.06,2.46 YLIM.1 | 85.73,3.68 88.08,3.68 ZLIM.1 | 85.73,3.68 OK1.2 | 328P.7 42.55,31.52 42.68,31.52 44.02,32.86 | C12.2 44.02,32.86 | Y-AXIS.5 36.02,41.51 44.02,33.51 44.02,32.86 | R3.P$1 11.24,16.7 11.24,25.21 IC1.OUT 12.7,41.29 12.48,41.51 X-AXIS.3 | X-AXIS.3 X-AXIS.1 9.75,42.55 8.89,42.55 7.62,43.81 v7.62,55.88
12V
  Top 1.016: 10.95,21.59 5.97,16.61 5.97,16.48 FAN.1 | 10.95,21.59 5.97,26.57 5.97,26.64 PWR.1 | 10.95,21.59 IC1.IN C9.+
A-DIR
  Top 0.406: JP1.4 67.74,35.24 67.74,35.75 68.5,36.51 73.27,36.51 77.47,40.72 79.61,40.72 81.66,42.77 83.48,42.77 STEPPERDRIVER3.DIR
A-STEP
  Top 0.406: JP1.3 67.74,37.78 67.74,38.29 68.8,39.35 73.83,39.35 76.75,42.27 76.75,45.74 79.47,48.47 86.64,48.47 STEPPERDRIVER3.STEP
  Bottom 0.406: STEPPERDRIVER3.STEP 87.83,48.54 R7.P$2
BTRXD  (via drill 0.33 pad 0.69)
  Top 0.406: v83.42,32.56 85.79,34.92 BT-TTL.3
  Bottom 0.406: COMMSEL.5 75.51,26.35 78.25,29.09 80.39,29.09 81.9,30.6 81.9,31.42 83.04,32.56 v83.42,32.56
BTTXD
  Top 0.406: BT-TTL.4 94.54,37.47 93.02,35.95 80.13,35.95 74.3,30.11 COMMSEL.6
COOLANT-FLOOD
  Bottom 0.406: 328P.26 52.7,23.9 51.28,25.33 25.74,25.33 20.79,20.38 20.79,11.46 20.32,10.99 CONN1.2
COOLANT-MIST
  Top 0.406: 328P.27 55.24,20.55 58.3,20.55 58.87,21.11 58.87,23.78 58.01,24.64 27.58,24.64 26.04,23.09 26.04,20.46 22.86,17.29 CONN1.4
CYCLE-START
  Bottom 0.406: 328P.25 50.16,20.55 50.05,20.55 39.24,9.74 39.24,9.3 38.39,8.45 38.1,8.45 CONN1.15
FEED-HOLD
  Bottom 0.406: 328P.24 47.62,23.9 46.88,24.64 35.21,24.64 33.49,22.92 33.49,11.46 33.02,10.99 CONN1.12
G-RESET
  Bottom 0.406: 328P.23 45.09,23.9 45.03,23.95 39.62,23.95 38.73,23.07 38.73,14.16 35.56,10.99 CONN1.14
GND  (via drill 0.33 pad 0.69)
  Top 0.406: ZLED.K 60.96,41.44 60.96,38.73 59.09,36.87 RESET.2 | RESET.1 51.64,36.35 C13.1 45.88,38.1 v43.18,38.1 42.55,38.1 | v39.85,35.72 42.55,38.1 | R2.P$2 v64.14,10.16 | v36.2,38.73 41.91,38.73 42.55,38.1 | v31.11,38.73 28.39,41.46 XLED.K | CONN1.13 CONN1.11 30.8,5.08 22.23,5.08 20.32,6.99 CONN1.1
  Bottom 0.406: 39.98,41.3 YLED.K | v36.2,38.73 v31.11,38.73
  pour Bottom: 0.64,0.64 0.64,79.38 99.69,79.38 99.69,51.44 8.26,51.44 8.26,48.26 92.08,48.26 92.08,49.53 99.69,49.53 99.69,0.64
MOTOR_DISABLE
  Top 0.406: 13.48,50.82 10.76,50.82 STEPPERDRIVER.!EN | 13.48,50.82 29.42,50.82 STEPPERDRIVER1.!EN 31.75,50.82 50.42,50.82 STEPPERDRIVER2.!EN 52.76,50.82 71.42,50.82 STEPPERDRIVER3.!EN | 13.48,50.82 13.48,47.91 13.75,47.65 13.75,42.21 24.43,31.52 24.77,31.52 328P.14 24.77,28.17 21.67,25.07 21.67,9.35 22.57,8.45 22.86,8.45 CONN1.3
  Bottom 0.406: STEPPERDRIVER3.!EN 71.72,48.78 71.72,44.63 67.79,40.7 67.79,34.77 64.14,31.12 R2.P$1
N$1
  Top 1.016: XMOT.1 26,73.21 22.29,69.5 STEPPERDRIVER.1B
N$2
  Bottom 1.016: XMOT.2 20.96,73.21 19.75,71.99 STEPPERDRIVER.1A
N$3
  Top 1.016: XMOT.3 15.99,73.21 17.21,71.99 STEPPERDRIVER.2A
N$4
  Bottom 1.016: XMOT.4 10.96,73.21 14.67,69.5 STEPPERDRIVER.2B
N$5
  Top 0.406: STEPPERDRIVER.!SLP STEPPERDRIVER.!RST
N$6
  Bottom 0.406: X-AXIS.2 9.94,46.49 12.13,48.68 STEPPERDRIVER.MS1
N$7
  Bottom 0.406: X-AXIS.4 12.48,46.49 14.67,48.68 STEPPERDRIVER.MS2
N$8
  Bottom 0.406: X-AXIS.6 15.02,46.49 17.21,48.68 STEPPERDRIVER.MS3
N$9
  Top 1.016: YMOT.1 46.99,73.21 43.29,69.5 STEPPERDRIVER1.1B
N$10
  Bottom 1.016: YMOT.2 41.97,73.21 40.75,71.99 STEPPERDRIVER1.1A
N$11
  Top 1.016: YMOT.3 36.99,73.21 38.21,71.99 STEPPERDRIVER1.2A
N$12
  Bottom 1.016: YMOT.4 31.96,73.21 35.67,69.5 STEPPERDRIVER1.2B
N$13
  Top 0.406: STEPPERDRIVER1.!SLP STEPPERDRIVER1.!RST
N$14
  Bottom 0.406: Y-AXIS.2 30.94,46.49 33.13,48.68 STEPPERDRIVER1.MS1
N$15
  Bottom 0.406: Y-AXIS.4 33.48,46.49 35.67,48.68 STEPPERDRIVER1.MS2
N$16
  Bottom 0.406: Y-AXIS.6 36.02,46.49 38.21,48.68 STEPPERDRIVER1.MS3
N$17
  Bottom 1.016: ZMOT.4 52.96,73.21 56.67,69.5 STEPPERDRIVER2.2B
N$18
  Top 1.016: ZMOT.3 57.99,73.21 59.21,71.99 STEPPERDRIVER2.2A
N$19
  Bottom 1.016: ZMOT.2 62.97,73.21 61.75,71.99 STEPPERDRIVER2.1A
N$20
  Top 1.016: ZMOT.1 68,73.21 64.29,69.5 STEPPERDRIVER2.1B
N$21
  Top 0.406: STEPPERDRIVER2.!SLP STEPPERDRIVER2.!RST
N$22
  Bottom 0.406: Z-AXIS.2 51.94,46.49 54.13,48.68 STEPPERDRIVER2.MS1
N$23
  Bottom 0.406: Z-AXIS.4 54.48,46.49 56.67,48.68 STEPPERDRIVER2.MS2
N$24
  Bottom 0.406: STEPPERDRIVER2.MS3 59.21,48.68 57.02,46.49 Z-AXIS.6
N$25
  Top 1.016: AMOT.1 89,73.21 85.29,69.5 STEPPERDRIVER3.1B
N$26
  Bottom 1.016: AMOT.2 83.97,73.21 82.75,71.99 STEPPERDRIVER3.1A
N$27
  Top 1.016: AMOT.3 78.99,73.21 80.21,71.99 STEPPERDRIVER3.2A
N$28
  Bottom 1.016: AMOT.4 73.96,73.21 77.67,69.5 STEPPERDRIVER3.2B
N$29
  Top 0.406: STEPPERDRIVER3.!SLP STEPPERDRIVER3.!RST
N$30
  Bottom 0.406: A-AXIS.2 72.94,46.49 75.13,48.68 STEPPERDRIVER3.MS1
N$31
  Top 0.406: A-AXIS.4 75.48,46.49 77.67,48.68 STEPPERDRIVER3.MS2
N$32
  Bottom 0.406: A-AXIS.6 78.02,46.49 80.21,48.68 STEPPERDRIVER3.MS3
N$33
  Bottom 0.406: Q2.1 37.47,35.69 C15.1 328P.9
N$34
  Bottom 0.406: 328P.10 C14.1 34.92,35.69 Q2.2
N$35
  Bottom 0.406: OK2.3 88.27,32.26 87.05,32.26 R8.P$2
N$36
  Bottom 0.406: OK1.3 88.27,18.26 81.57,18.26 R11.P$1
N$37
  Top 0.406: XSTLED.A 74.36,13.27 R12.P$2
N$38
  Bottom 0.406: XLED.A 18.98,45.07 19.05,45.14 R4.P$1
N$39
  Bottom 0.406: YLED.A 39.98,45.07 40.01,45.1 R5.P$1
N$40
  Bottom 0.406: ZLED.A 60.98,45.07 60.96,45.08 R6.P$1
N$41
  Bottom 0.406: R7.P$1 81.98,46.58 ALED.A
N$42
  Top 0.406: YSTLED.A 82.01,13.27 80.68,11.94 72.83,11.94 R13.P$2
N$43
  Bottom 0.406: R3.P$2 12.38,7.94 PWRLED1.A
N$44
  Top 0.406: ZSTLED.A 87.01,13.27 85.55,14.73 69.98,14.73 R14.P$2
N$45  (via drill 0.33 pad 0.69)
  Top 0.406: CONN1.16 39.24,9.84 39.77,10.38 v41.76,10.38
  Bottom 0.406: D1.A 44.88,13.49 v41.76,10.38
PWRMOT
  Top 1.27: 48.9,52.7 69.85,52.7 72.39,55.24 72.39,62.15 STEPPERDRIVER3.VMOT 72.39,62.55 72.39,66.67 72.94,67.23 C8.+ | 48.9,52.7 27.94,52.7 | 27.94,52.7 6.99,52.7 | 48.9,52.7 51.44,55.24 51.44,62.2 STEPPERDRIVER2.VMOT 51.44,62.5 51.44,66.67 51.98,67.22 C6.+ | 27.94,52.7 30.48,55.24 30.48,62.24 STEPPERDRIVER1.VMOT 30.48,62.46 30.48,66.67 30.98,67.17 C4.+ | C2.+ 9.98,67.13 9.53,66.67 9.53,62.41 STEPPERDRIVER.VMOT 9.53,62.29 9.53,55.24 6.99,52.7 | 6.99,52.7 3.17,48.9 PWR-MOT.1
RESERVED
  Top 0.406: 328P.28 57.78,23.9 57.72,23.97 29.45,23.97 28.57,23.09 28.57,17 25.4,13.82 CONN1.6
RESET
  Top 0.406: RESET.3 56.96,32.35 57.78,31.52 | 328P.1 57.78,31.52 | RESET.4 57.83,31.52 57.78,31.52 | R1.P$1 63.96,32.21 73.22,32.21 77.69,36.68 91.9,36.68 96.34,41.12 96.36,41.12 ESTOP.1
  Bottom 0.406: ICSP.5 54.03,8.57 53.32,9.27 53.32,13.45 54.03,14.15 54.03,24.41 57.78,28.17 328P.1 | C13.2 46.15,36.35 46.15,36.24 50.05,32.35 RESET.3 | R1.P$1 59.09,32.35 RESET.4
RXD
  Top 0.406: 328P.2 55.24,28.57 55.88,27.94 64.77,27.94 67.31,30.48 70.48,30.48 71.75,29.21 COMMSEL.4
RXDUSB
  Top 0.406: OK2.6 88.27,37.74 87.9,37.38 79.06,37.38 R9.P$2
  Bottom 0.406: COMMSEL.1 70.43,26.35 70.43,26.86 71.2,27.62 72.23,27.62 72.97,28.37 72.97,34.16 R9.P$2
SPINDLE-DIR
  Top 0.406: CONN1.8 29.08,9.84 29.08,10.08 30.18,11.18 53.96,11.18 54.03,11.11 ICSP.3
  Bottom 0.406: CONN1.8 27.94,8.7 28.18,8.7 29.21,7.67 29.21,6.94 30.05,6.11 33.52,6.11 34.26,6.84 34.26,19.88 34.92,20.55 328P.19 | JP1.2 69.06,34.02 65.84,30.81 65.84,29.48 59.76,23.41 59.76,18.78 56.5,15.51 56.5,12.36 ICSP.3
SPINDLE-ENABLE
  Top 0.406: 328P.18 32.38,20.55 34.84,18.09 49.58,18.09 54.03,13.65 ICSP.1
  Bottom 0.406: 328P.18 32.38,20.55 30.48,18.64 CONN1.10 | ICSP.1 55.24,12.43 54.74,12.43 54,11.69 54,10.62 54.73,9.89 58.3,9.89 68,19.59 68,31.04 70.28,33.33 70.28,35.79 69.51,36.56 69.06,36.56 JP1.1
TXD
  Top 0.406: 328P.3 52.7,27.94 53.66,26.99 59.37,26.99 61.59,24.77 70.48,24.77 71.75,26.04 COMMSEL.3
TXDUSB
  Top 0.406: COMMSEL.2 70.43,28.89 70.43,28.39 71.2,27.62 77.69,27.62 R11.P$2
USB_5V
  Top 0.406: TTL.3 96.44,17.78 93.06,20.53 90.01,20.53 OK1.7 C11.1
  Bottom 0.406: OK1.7 85.73,23.74 83.19,23.74 OK1.8 83.19,27.1 77.93,27.1 76.2,25.36 76.2,18.62 R10.P$2 | OK2.2 C11.1
USB_GND
  Top 0.406: TTL.1 94.82,22.86 94.08,23.39 | 94.08,23.39 93.44,23.39 90.81,23.39 OK1.5 90.81,27.45 90.24,27.45 89.69,28 C11.2 | GND.1 93.98,26.67 93.98,23.5 94.08,23.39
  Bottom 0.406: TTL.2 TTL.1
USB_RXD
  Bottom 0.406: 88.27,23.06 94.54,16.79 94.54,13.97 TTL.5 | 88.27,23.06 79.38,23.06 R10.P$1 | OK1.6 88.27,23.06
USB_TXD
  Top 0.406: R8.P$1 80.5,30.24 84.36,26.39 84.36,24.66 89.97,19.05 92,19.05 96.44,15.24 TTL.4
X-DIR
  Bottom 0.406: 328P.11 32.38,31.52 32.27,31.52 28.43,35.36 28.43,48.11 STEPPERDRIVER.DIR
X-STEP
  Bottom 0.406: STEPPERDRIVER.STEP 26.67,47.81 R4.P$2 26.67,35.97 31.11,31.53 31.11,28.97 31.98,28.11 50.1,28.11 50.16,28.17 328P.4
X-STOP
  Top 0.406: XLIM.2 75.01,5 R12.P$1 72.87,4.29 49.35,4.29 45.11,8.53 32.49,8.53 31.62,7.66 31.62,7.3 CONN1.9
  Bottom 0.406: 328P.15 24.77,20.55 29.21,16.1 29.21,9.47 30.23,8.45 30.48,8.45 CONN1.9
Y-DIR
  Top 0.406: 328P.12 29.84,31.52 34.95,31.52 36.01,32.57 36.01,33.09 37.65,34.74 62.25,34.74 62.76,35.24 JP1.6
  Bottom 0.406: JP1.6 62.76,35.24 58.65,39.35 56.1,39.35 53.21,42.25 53.21,43.2 52.46,43.95 51.53,43.95 49.88,45.6 49.88,48.14 STEPPERDRIVER1.DIR
Y-STEP
  Bottom 0.406: JP1.5 63.98,36.56 64.48,36.56 65.25,35.8 65.25,34.75 64.51,34.02 52.18,34.02 47.62,38.58 | 47.62,38.58 R5.P$2 45.83,48.47 STEPPERDRIVER1.STEP | 47.62,38.58 45.8,38.58 44,36.79 44,35.89 46.32,33.58 46.32,32.58 46.35,32.54 46.35,31.75 47.62,30.48 328P.5
Y-STOP
  Top 0.406: 328P.16 27.3,20.55 24.23,17.48 24.23,6.85 24.96,6.12 25.9,6.12 26.8,7.02 26.8,7.3 CONN1.7 | R13.P$1 72.84,7.12 74.89,7.12 75.79,6.22 83.08,6.22 YLIM.2
  Bottom 0.406: CONN1.7 27.94,6.16 32.22,1.88 67.6,1.88 R13.P$1
Z-DIR
  Top 0.406: STEPPERDRIVER2.DIR 62.45,42.73 60.01,42.73 57.62,40.34 35.76,40.34 27.3,31.89 328P.13
Z-STEP
  Top 0.406: 328P.6 45.09,31.52 49.28,31.52 51.67,33.91 64.37,33.91 65.25,34.78 65.25,43.34 R6.P$2
  Bottom 0.406: R6.P$2 68.58,47.9 STEPPERDRIVER2.STEP
Z-STOP
  Top 0.406: ZLIM.2 88.08,6.22 86.76,6.22 85.18,7.8 85.18,8.06 84.41,8.83 71.7,8.83 R14.P$1 64.4,5.71 59,11.11 ICSP.4 56.57,11.11 56.57,11.62 55.8,12.38 50.08,12.38 49.72,12.03 29.84,12.03 | 29.84,12.03 328P.17 | 29.84,12.03 28.48,12.03 26.54,10.09 26.54,9.3 25.69,8.45 25.4,8.45 CONN1.5

### Text on the board
tPlace: - Y - | - A -
tNames: C6 | C8 | 1 2 3 | 1 2 3 | 1 2 3 | 1 2 3 | XStepper 0.91/2013 | MS1 MS2 MS3 Res / yes ___ ___ 2x / ___ yes ___ 4x / yes yes ___ 8x / yes yes yes 16x | Step | Rx | + | 6N137 | Dir | Tx | - | GND | -BT- | 5V | Tx | Rx | + | -TTL- | - | 6N137 | GND | CTS | 5V | + | VCC | Tx | MISO | - | Fld | Mist | Res | SP-D | SP-E | Feed | Rset | VCC | MOSI | Rx | SCK | DTR | RST | GND | GND | SIG | VCC | GND | MDis | ZLim | YLim | XLim | GND | GND | Strt